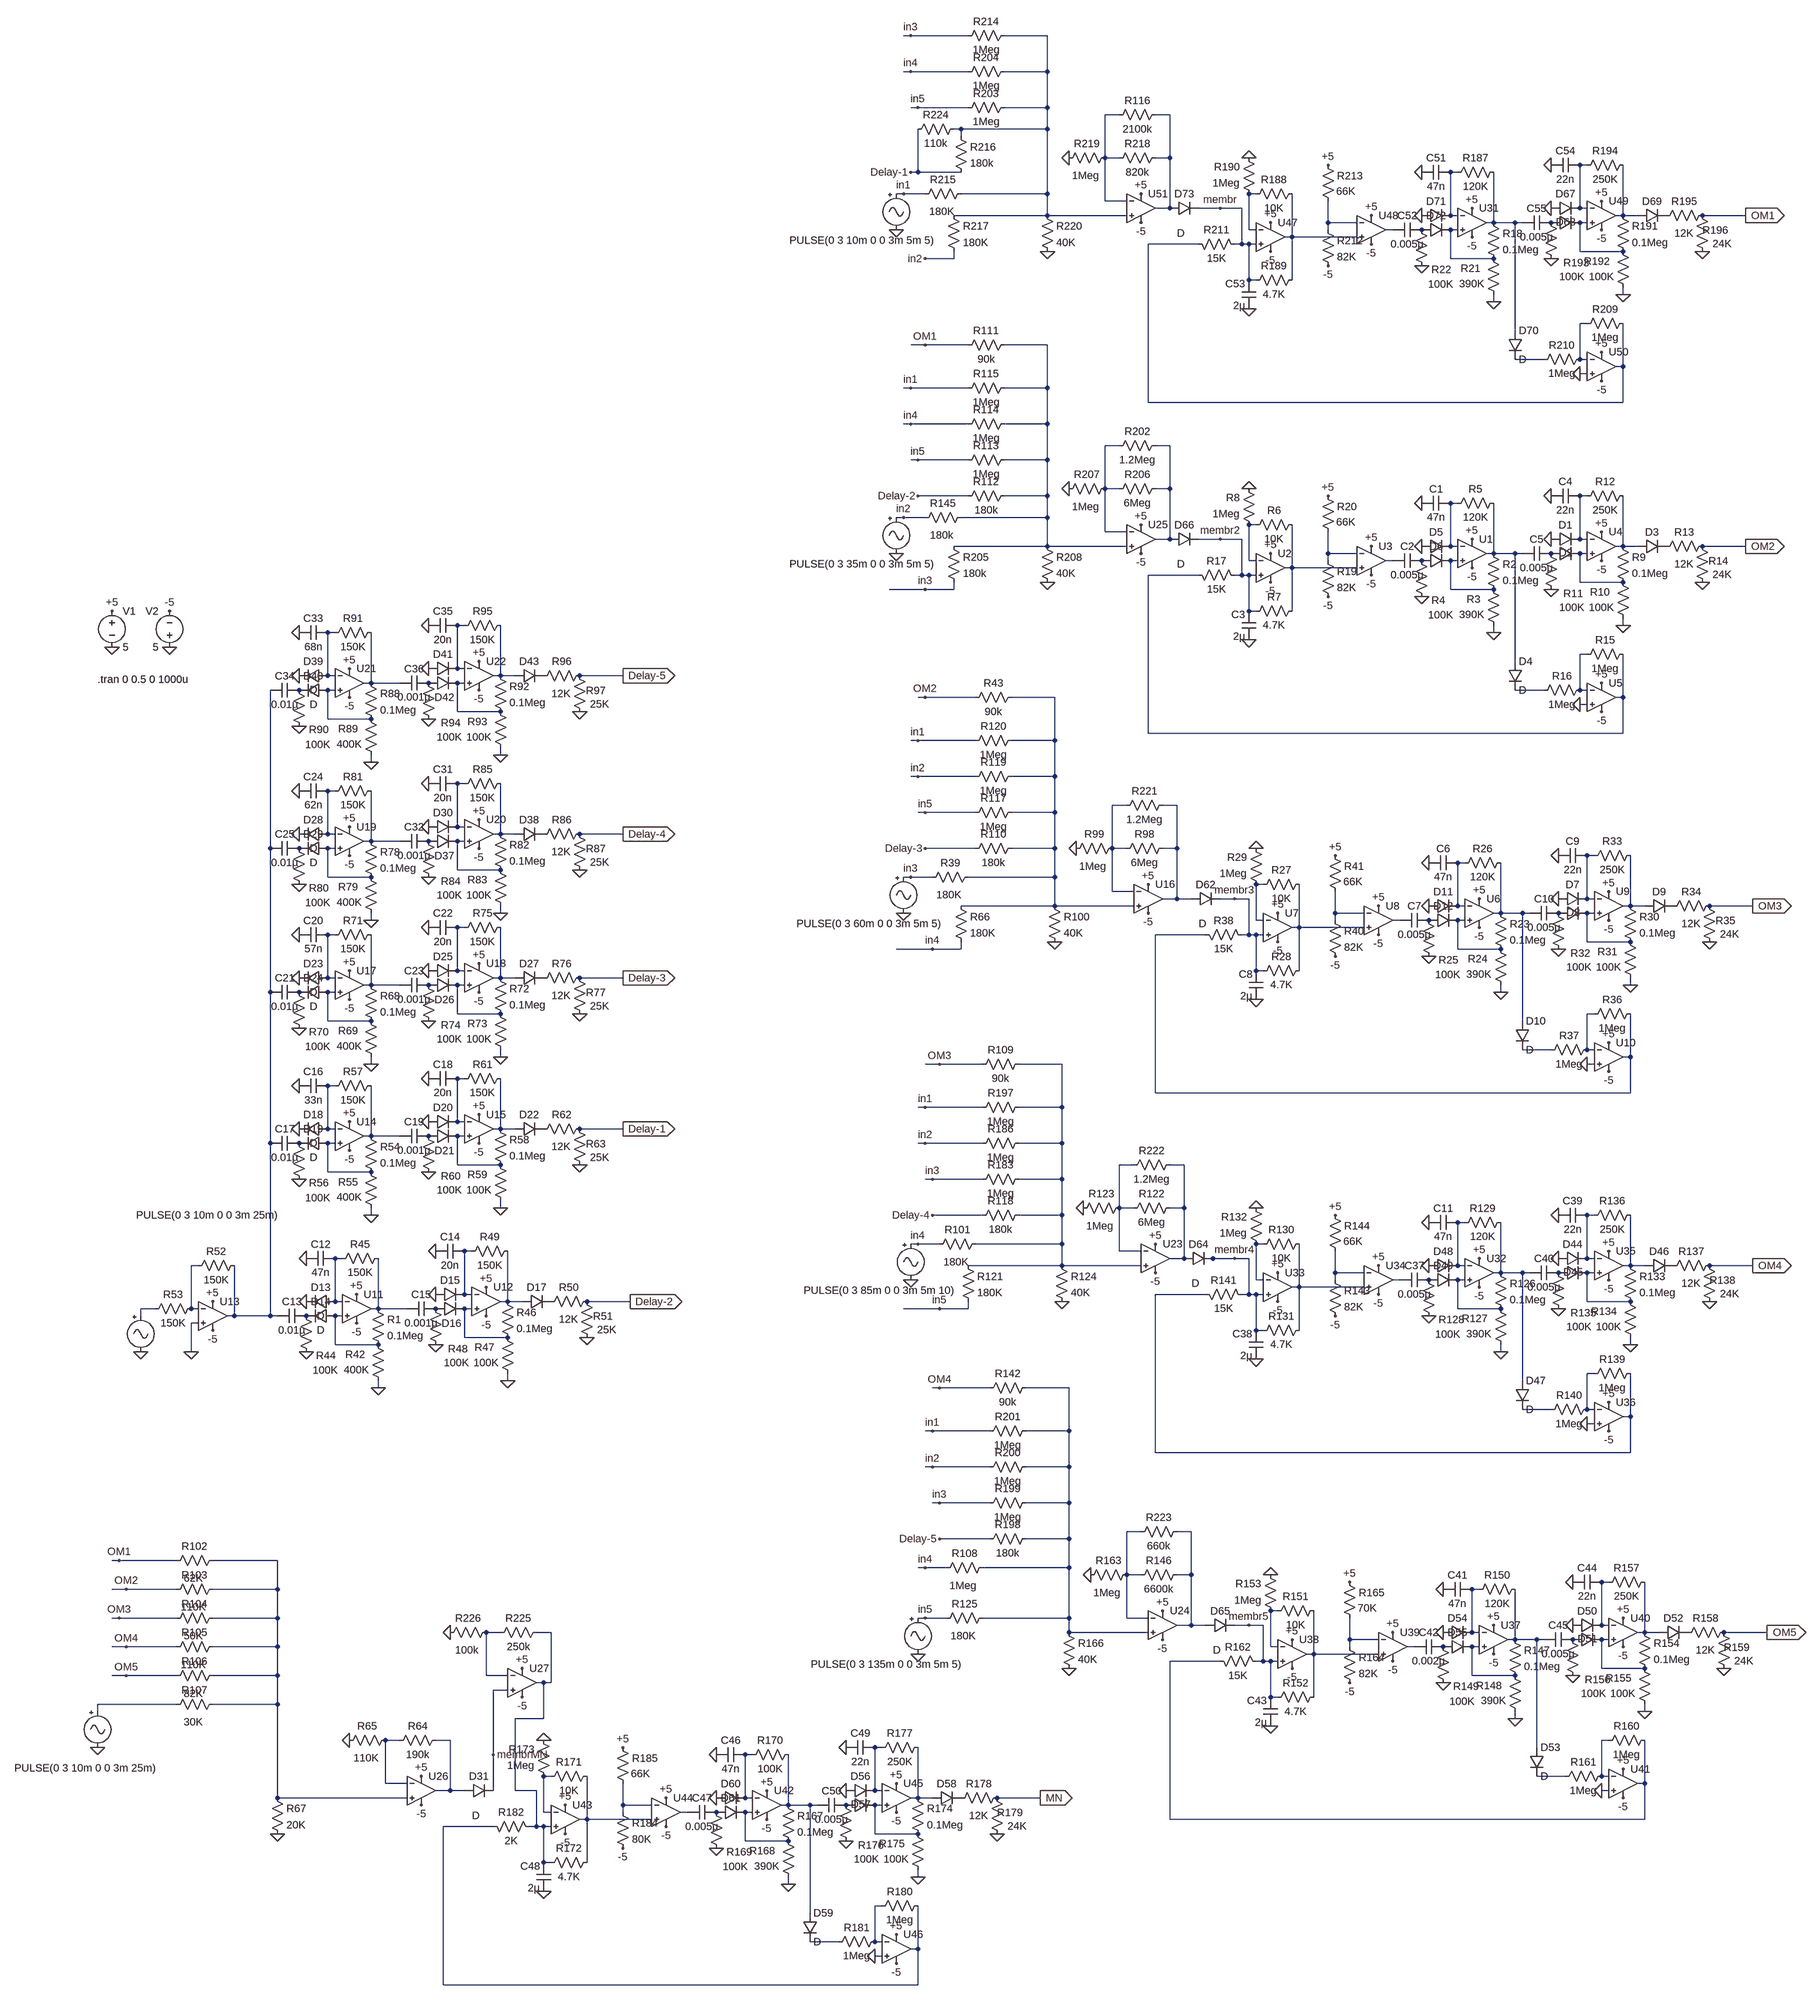
[diagram p0: schematic somaforprototype.asc]
* somaforprototype.asc
V1 +5 0 5
V2 0 -5 5
XU17 N065 N060 +5 -5 N063 level.2 Avol=1Meg GBW=10Meg Slew=10Meg ilimit=25m rail=0 Vos=0 phimargin=45 en=0 enk=0 in=0 ink=0 Rin=500Meg  ; pins IN+ IN- V+ V- OUT
D23 N060 0 D
D24 N065 P001 D
R68 N063 N065 0.1Meg
R69 0 N065 400K
R70 P001 0 100K
R71 N063 N060 150K
C20 N060 0 57n
C21 P001 N047 0.01µ
XU18 N064 N058 +5 -5 N062 level.2 Avol=1Meg GBW=10Meg Slew=10Meg ilimit=25m rail=0 Vos=0 phimargin=45 en=0 enk=0 in=0 ink=0 Rin=500Meg  ; pins IN+ IN- V+ V- OUT
D25 0 N058 D
D26 P002 N064 D
R72 N062 N064 0.1Meg
R73 0 N064 100K
R74 P002 0 100K
R75 N062 N058 150K
C22 N058 0 20n
C23 P002 N063 0.001µ
D27 N062 P003 D
R76 Delay-3 P003 12K
R77 0 Delay-3 25K
XU19 N048 N041 +5 -5 N045 level.2 Avol=1Meg GBW=10Meg Slew=10Meg ilimit=25m rail=0 Vos=0 phimargin=45 en=0 enk=0 in=0 ink=0 Rin=500Meg  ; pins IN+ IN- V+ V- OUT
D28 N041 0 D
D29 N048 P004 D
R78 N045 N048 0.1Meg
R79 0 N048 400K
R80 P004 0 100K
R81 N045 N041 150K
C24 N041 0 62n
C25 P004 N047 0.01µ
XU20 N046 N040 +5 -5 N044 level.2 Avol=1Meg GBW=10Meg Slew=10Meg ilimit=25m rail=0 Vos=0 phimargin=45 en=0 enk=0 in=0 ink=0 Rin=500Meg  ; pins IN+ IN- V+ V- OUT
D30 0 N040 D
D37 P005 N046 D
R82 N044 N046 0.1Meg
R83 0 N046 100K
R84 P005 0 100K
R85 N044 N040 150K
C31 N040 0 20n
C32 P005 N045 0.001µ
D38 N044 P006 D
R86 Delay-4 P006 12K
R87 0 Delay-4 25K
XU21 N037 N032 +5 -5 N035 level.2 Avol=1Meg GBW=10Meg Slew=10Meg ilimit=25m rail=0 Vos=0 phimargin=45 en=0 enk=0 in=0 ink=0 Rin=500Meg  ; pins IN+ IN- V+ V- OUT
D39 N032 0 D
D40 N037 P007 D
R88 N035 N037 0.1Meg
R89 0 N037 400K
R90 P007 0 100K
R91 N035 N032 150K
C33 N032 0 68n
C34 P007 N047 0.01µ
XU22 N036 N031 +5 -5 N034 level.2 Avol=1Meg GBW=10Meg Slew=10Meg ilimit=25m rail=0 Vos=0 phimargin=45 en=0 enk=0 in=0 ink=0 Rin=500Meg  ; pins IN+ IN- V+ V- OUT
D41 0 N031 D
D42 P008 N036 D
R92 N034 N036 0.1Meg
R93 0 N036 100K
R94 P008 0 100K
R95 N034 N031 150K
C35 N031 0 20n
C36 P008 N035 0.001µ
D43 N034 P009 D
R96 Delay-5 P009 12K
R97 0 Delay-5 25K
XU1 N028 N021 +5 -5 N025 level.2 Avol=1Meg GBW=10Meg Slew=10Meg ilimit=25m rail=0 Vos=0 phimargin=45 en=0 enk=0 in=0 ink=0 Rin=500Meg  ; pins IN+ IN- V+ V- OUT
R2 N025 N028 0.1Meg
R3 0 N028 390K
R4 P010 0 100K
R5 N025 N021 120K
C1 N021 0 47n
C2 P010 N027 0.005µ
XU2 membr2 N022 +5 -5 N029 level.2 Avol=1Meg GBW=10Meg Slew=10Meg ilimit=25m rail=0 Vos=0 phimargin=45 en=0 enk=0 in=0 ink=0 Rin=500Meg  ; pins IN+ IN- V+ V- OUT
C3 0 membr2 2µ
R6 N029 N022 10K
R7 N029 membr2 4.7K
R8 N022 0 1Meg
XU3 N029 N024 +5 -5 N027 level.2 Avol=1Meg GBW=10Meg Slew=10Meg ilimit=25m rail=0 Vos=0 phimargin=45 en=0 enk=0 in=0 ink=0 Rin=500Meg  ; pins IN+ IN- V+ V- OUT
XU4 N026 N020 +5 -5 N023 level.2 Avol=1Meg GBW=10Meg Slew=10Meg ilimit=25m rail=0 Vos=0 phimargin=45 en=0 enk=0 in=0 ink=0 Rin=500Meg  ; pins IN+ IN- V+ V- OUT
D1 0 N020 D
D2 P011 N026 D
R9 N023 N026 0.1Meg
R10 0 N026 100K
R11 P011 0 100K
R12 N023 N020 250K
C4 N020 0 22n
C5 P011 N025 0.005µ
D3 N023 P012 D
R13 OM2 P012 12K
R14 0 OM2 24K
XU5 0 N033 +5 -5 N030 level.2 Avol=1Meg GBW=10Meg Slew=10Meg ilimit=25m rail=0 Vos=0 phimargin=45 en=0 enk=0 in=0 ink=0 Rin=500Meg  ; pins IN+ IN- V+ V- OUT
R15 N030 N033 1Meg
R16 N038 N033 1Meg
D4 N025 N038 D
R17 N030 membr2 15K
R19 N024 -5 82K
R20 +5 N024 66K
D5 0 N021 D
D6 P010 N028 D
XU6 N057 N050 +5 -5 N054 level.2 Avol=1Meg GBW=10Meg Slew=10Meg ilimit=25m rail=0 Vos=0 phimargin=45 en=0 enk=0 in=0 ink=0 Rin=500Meg  ; pins IN+ IN- V+ V- OUT
R23 N054 N057 0.1Meg
R24 0 N057 390K
R25 P013 0 100K
R26 N054 N050 120K
C6 N050 0 47n
C7 P013 N056 0.005µ
XU7 membr3 N051 +5 -5 N059 level.2 Avol=1Meg GBW=10Meg Slew=10Meg ilimit=25m rail=0 Vos=0 phimargin=45 en=0 enk=0 in=0 ink=0 Rin=500Meg  ; pins IN+ IN- V+ V- OUT
C8 0 membr3 2µ
R27 N059 N051 10K
R28 N059 membr3 4.7K
R29 N051 0 1Meg
XU8 N059 N053 +5 -5 N056 level.2 Avol=1Meg GBW=10Meg Slew=10Meg ilimit=25m rail=0 Vos=0 phimargin=45 en=0 enk=0 in=0 ink=0 Rin=500Meg  ; pins IN+ IN- V+ V- OUT
XU9 N055 N049 +5 -5 N052 level.2 Avol=1Meg GBW=10Meg Slew=10Meg ilimit=25m rail=0 Vos=0 phimargin=45 en=0 enk=0 in=0 ink=0 Rin=500Meg  ; pins IN+ IN- V+ V- OUT
D7 0 N049 D
D8 P014 N055 D
R30 N052 N055 0.1Meg
R31 0 N055 100K
R32 P014 0 100K
R33 N052 N049 250K
C9 N049 0 22n
C10 P014 N054 0.005µ
D9 N052 P015 D
R34 OM3 P015 12K
R35 0 OM3 24K
XU10 0 N066 +5 -5 N061 level.2 Avol=1Meg GBW=10Meg Slew=10Meg ilimit=25m rail=0 Vos=0 phimargin=45 en=0 enk=0 in=0 ink=0 Rin=500Meg  ; pins IN+ IN- V+ V- OUT
R36 N061 N066 1Meg
R37 N067 N066 1Meg
D10 N054 N067 D
R38 N061 membr3 15K
R40 N053 -5 82K
R41 +5 N053 66K
D11 0 N050 D
D12 P013 N057 D
XU32 N088 N078 +5 -5 N085 level.2 Avol=1Meg GBW=10Meg Slew=10Meg ilimit=25m rail=0 Vos=0 phimargin=45 en=0 enk=0 in=0 ink=0 Rin=500Meg  ; pins IN+ IN- V+ V- OUT
R126 N085 N088 0.1Meg
R127 0 N088 390K
R128 P016 0 100K
R129 N085 N078 120K
C11 N078 0 47n
C37 P016 N087 0.005µ
XU33 membr4 N079 +5 -5 N089 level.2 Avol=1Meg GBW=10Meg Slew=10Meg ilimit=25m rail=0 Vos=0 phimargin=45 en=0 enk=0 in=0 ink=0 Rin=500Meg  ; pins IN+ IN- V+ V- OUT
C38 0 membr4 2µ
R130 N089 N079 10K
R131 N089 membr4 4.7K
R132 N079 0 1Meg
XU34 N089 N084 +5 -5 N087 level.2 Avol=1Meg GBW=10Meg Slew=10Meg ilimit=25m rail=0 Vos=0 phimargin=45 en=0 enk=0 in=0 ink=0 Rin=500Meg  ; pins IN+ IN- V+ V- OUT
XU35 N086 N077 +5 -5 N083 level.2 Avol=1Meg GBW=10Meg Slew=10Meg ilimit=25m rail=0 Vos=0 phimargin=45 en=0 enk=0 in=0 ink=0 Rin=500Meg  ; pins IN+ IN- V+ V- OUT
D44 0 N077 D
D45 P017 N086 D
R133 N083 N086 0.1Meg
R134 0 N086 100K
R135 P017 0 100K
R136 N083 N077 250K
C39 N077 0 22n
C40 P017 N085 0.005µ
D46 N083 P018 D
R137 OM4 P018 12K
R138 0 OM4 24K
XU36 0 N096 +5 -5 N090 level.2 Avol=1Meg GBW=10Meg Slew=10Meg ilimit=25m rail=0 Vos=0 phimargin=45 en=0 enk=0 in=0 ink=0 Rin=500Meg  ; pins IN+ IN- V+ V- OUT
R139 N090 N096 1Meg
R140 N098 N096 1Meg
D47 N085 N098 D
R141 N090 membr4 15K
R143 N084 -5 82K
R144 +5 N084 66K
D48 0 N078 D
D49 P016 N088 D
XU37 N112 N103 +5 -5 N109 level.2 Avol=1Meg GBW=10Meg Slew=10Meg ilimit=25m rail=0 Vos=0 phimargin=45 en=0 enk=0 in=0 ink=0 Rin=500Meg  ; pins IN+ IN- V+ V- OUT
R147 N109 N112 0.1Meg
R148 0 N112 390K
R149 P019 0 100K
R150 N109 N103 120K
C41 N103 0 47n
C42 P019 N111 0.002µ
XU38 membr5 N104 +5 -5 N113 level.2 Avol=1Meg GBW=10Meg Slew=10Meg ilimit=25m rail=0 Vos=0 phimargin=45 en=0 enk=0 in=0 ink=0 Rin=500Meg  ; pins IN+ IN- V+ V- OUT
C43 0 membr5 2µ
R151 N113 N104 10K
R152 N113 membr5 4.7K
R153 N104 0 1Meg
XU39 N113 N108 +5 -5 N111 level.2 Avol=1Meg GBW=10Meg Slew=10Meg ilimit=25m rail=0 Vos=0 phimargin=45 en=0 enk=0 in=0 ink=0 Rin=500Meg  ; pins IN+ IN- V+ V- OUT
XU40 N110 N102 +5 -5 N107 level.2 Avol=1Meg GBW=10Meg Slew=10Meg ilimit=25m rail=0 Vos=0 phimargin=45 en=0 enk=0 in=0 ink=0 Rin=500Meg  ; pins IN+ IN- V+ V- OUT
D50 0 N102 D
D51 P020 N110 D
R154 N107 N110 0.1Meg
R155 0 N110 100K
R156 P020 0 100K
R157 N107 N102 250K
C44 N102 0 22n
C45 P020 N109 0.005µ
D52 N107 P021 D
R158 OM5 P021 12K
R159 0 OM5 24K
XU41 0 N118 +5 -5 N114 level.2 Avol=1Meg GBW=10Meg Slew=10Meg ilimit=25m rail=0 Vos=0 phimargin=45 en=0 enk=0 in=0 ink=0 Rin=500Meg  ; pins IN+ IN- V+ V- OUT
R160 N114 N118 1Meg
R161 N122 N118 1Meg
D53 N109 N122 D
R162 N114 membr5 15K
R164 N108 -5 82K
R165 +5 N108 70K
D54 0 N103 D
D55 P019 N112 D
XU42 N128 N120 +5 -5 N125 level.2 Avol=1Meg GBW=10Meg Slew=10Meg ilimit=25m rail=0 Vos=0 phimargin=45 en=0 enk=0 in=0 ink=0 Rin=500Meg  ; pins IN+ IN- V+ V- OUT
R167 N125 N128 0.1Meg
R168 0 N128 390K
R169 P022 0 100K
R170 N125 N120 100K
C46 N120 0 47n
C47 P022 N127 0.005µ
XU43 N106 N121 +5 -5 N129 level.2 Avol=1Meg GBW=10Meg Slew=10Meg ilimit=25m rail=0 Vos=0 phimargin=45 en=0 enk=0 in=0 ink=0 Rin=500Meg  ; pins IN+ IN- V+ V- OUT
C48 0 N106 2µ
R171 N129 N121 10K
R172 N129 N106 4.7K
R173 N121 0 1Meg
XU44 N129 N124 +5 -5 N127 level.2 Avol=1Meg GBW=10Meg Slew=10Meg ilimit=25m rail=0 Vos=0 phimargin=45 en=0 enk=0 in=0 ink=0 Rin=500Meg  ; pins IN+ IN- V+ V- OUT
XU45 N126 N119 +5 -5 N123 level.2 Avol=1Meg GBW=10Meg Slew=10Meg ilimit=25m rail=0 Vos=0 phimargin=45 en=0 enk=0 in=0 ink=0 Rin=500Meg  ; pins IN+ IN- V+ V- OUT
D56 0 N119 D
D57 P023 N126 D
R174 N123 N126 0.1Meg
R175 0 N126 100K
R176 P023 0 100K
R177 N123 N119 250K
C49 N119 0 22n
C50 P023 N125 0.005µ
D58 N123 P024 D
R178 MN P024 12K
R179 0 MN 24K
XU46 0 N131 +5 -5 N130 level.2 Avol=1Meg GBW=10Meg Slew=10Meg ilimit=25m rail=0 Vos=0 phimargin=45 en=0 enk=0 in=0 ink=0 Rin=500Meg  ; pins IN+ IN- V+ V- OUT
R180 N130 N131 1Meg
R181 N132 N131 1Meg
D59 N125 N132 D
R182 N130 N106 2K
R184 N124 -5 80K
R185 +5 N124 66K
D60 0 N120 D
D61 P022 N128 D
R39 N039 in3 180K
V4 in3 0 PULSE(0 3 60m 0 0 3m 5m 5)
R66 N039 in4 180K
XU16 N039 N042 +5 -5 N043 level.2 Avol=1Meg GBW=10Meg Slew=10Meg ilimit=25m rail=0 Vos=0 phimargin=45 en=0 enk=0 in=0 ink=0 Rin=500Meg  ; pins IN+ IN- V+ V- OUT
R98 N043 N042 6Meg
R99 N042 0 1Meg
D62 N043 membr3 D
R100 N039 0 40K
R101 N068 in4 180K
V5 in4 0 PULSE(0 3 85m 0 0 3m 5m 10)
R121 N068 in5 180K
XU23 N068 N075 +5 -5 N076 level.2 Avol=1Meg GBW=10Meg Slew=10Meg ilimit=25m rail=0 Vos=0 phimargin=45 en=0 enk=0 in=0 ink=0 Rin=500Meg  ; pins IN+ IN- V+ V- OUT
R122 N076 N075 6Meg
R123 N075 0 1Meg
D64 N076 membr4 D
R124 N068 0 40K
R125 N097 in5 180K
V7 in5 0 PULSE(0 3 135m 0 0 3m 5m 5)
XU24 N097 N099 +5 -5 N100 level.2 Avol=1Meg GBW=10Meg Slew=10Meg ilimit=25m rail=0 Vos=0 phimargin=45 en=0 enk=0 in=0 ink=0 Rin=500Meg  ; pins IN+ IN- V+ V- OUT
R146 N100 N099 6600k
R163 N099 0 1Meg
D65 N100 membr5 D
R166 N097 0 40K
R145 N016 in2 180k
V10 in2 0 PULSE(0 3 35m 0 0 3m 5m 5)
R205 N016 in3 180k
XU25 N016 N018 +5 -5 N019 level.2 Avol=1Meg GBW=10Meg Slew=10Meg ilimit=25m rail=0 Vos=0 phimargin=45 en=0 enk=0 in=0 ink=0 Rin=500Meg  ; pins IN+ IN- V+ V- OUT
R206 N019 N018 6Meg
R207 N018 0 1Meg
D66 N019 membr2 D
R208 N016 0 40K
XU31 N012 N005 +5 -5 N009 level.2 Avol=1Meg GBW=10Meg Slew=10Meg ilimit=25m rail=0 Vos=0 phimargin=45 en=0 enk=0 in=0 ink=0 Rin=500Meg  ; pins IN+ IN- V+ V- OUT
R18 N009 N012 0.1Meg
R21 0 N012 390K
R22 P025 0 100K
R187 N009 N005 120K
C51 N005 0 47n
C52 P025 N011 0.005µ
XU47 membr N006 +5 -5 N013 level.2 Avol=1Meg GBW=10Meg Slew=10Meg ilimit=25m rail=0 Vos=0 phimargin=45 en=0 enk=0 in=0 ink=0 Rin=500Meg  ; pins IN+ IN- V+ V- OUT
C53 0 membr 2µ
R188 N013 N006 10K
R189 N013 membr 4.7K
R190 N006 0 1Meg
XU48 N013 N008 +5 -5 N011 level.2 Avol=1Meg GBW=10Meg Slew=10Meg ilimit=25m rail=0 Vos=0 phimargin=45 en=0 enk=0 in=0 ink=0 Rin=500Meg  ; pins IN+ IN- V+ V- OUT
XU49 N010 N004 +5 -5 N007 level.2 Avol=1Meg GBW=10Meg Slew=10Meg ilimit=25m rail=0 Vos=0 phimargin=45 en=0 enk=0 in=0 ink=0 Rin=500Meg  ; pins IN+ IN- V+ V- OUT
D67 0 N004 D
D68 P026 N010 D
R191 N007 N010 0.1Meg
R192 0 N010 100K
R193 P026 0 100K
R194 N007 N004 250K
C54 N004 0 22n
C55 P026 N009 0.005µ
D69 N007 P027 D
R195 OM1 P027 12K
R196 0 OM1 24K
XU50 0 N015 +5 -5 N014 level.2 Avol=1Meg GBW=10Meg Slew=10Meg ilimit=25m rail=0 Vos=0 phimargin=45 en=0 enk=0 in=0 ink=0 Rin=500Meg  ; pins IN+ IN- V+ V- OUT
R209 N014 N015 1Meg
R210 N017 N015 1Meg
D70 N009 N017 D
R211 N014 membr 15K
R212 N008 -5 82K
R213 +5 N008 66K
D71 0 N005 D
D72 P025 N012 D
R215 N001 in1 180K
R216 N001 Delay-1 180k
R217 N001 in2 180K
XU51 N001 N002 +5 -5 N003 level.2 Avol=1Meg GBW=10Meg Slew=10Meg ilimit=25m rail=0 Vos=0 phimargin=45 en=0 enk=0 in=0 ink=0 Rin=500Meg  ; pins IN+ IN- V+ V- OUT
R218 N003 N002 820k
R219 N002 0 1Meg
D73 N003 membr D
R220 N001 0 40K
V3 in1 0 PULSE(0 3 10m 0 0 3m 5m 5)
XU11 N095 N081 +5 -5 N093 level.2 Avol=1Meg GBW=10Meg Slew=10Meg ilimit=25m rail=0 Vos=0 phimargin=45 en=0 enk=0 in=0 ink=0 Rin=500Meg  ; pins IN+ IN- V+ V- OUT
D13 N081 0 D
D14 N095 P028 D
R1 N093 N095 0.1Meg
R42 0 N095 400K
R44 P028 0 100K
R45 N093 N081 150K
C12 N081 0 47n
C13 P028 N047 0.01µ
V11 N092 0 PULSE(0 3 10m 0 0 3m 25m)
XU12 N094 N080 +5 -5 N091 level.2 Avol=1Meg GBW=10Meg Slew=10Meg ilimit=25m rail=0 Vos=0 phimargin=45 en=0 enk=0 in=0 ink=0 Rin=500Meg  ; pins IN+ IN- V+ V- OUT
D15 0 N080 D
D16 P029 N094 D
R46 N091 N094 0.1Meg
R47 0 N094 100K
R48 P029 0 100K
R49 N091 N080 150K
C14 N080 0 20n
C15 P029 N093 0.001µ
D17 N091 P030 D
R50 Delay-2 P030 12K
R51 0 Delay-2 25K
XU13 0 N082 +5 -5 N047 level.2 Avol=1Meg GBW=10Meg Slew=10Meg ilimit=25m rail=0 Vos=0 phimargin=45 en=0 enk=0 in=0 ink=0 Rin=500Meg  ; pins IN+ IN- V+ V- OUT
R52 N047 N082 150K
R53 N082 N092 150K
XU14 N074 N070 +5 -5 N072 level.2 Avol=1Meg GBW=10Meg Slew=10Meg ilimit=25m rail=0 Vos=0 phimargin=45 en=0 enk=0 in=0 ink=0 Rin=500Meg  ; pins IN+ IN- V+ V- OUT
D18 N070 0 D
D19 N074 P031 D
R54 N072 N074 0.1Meg
R55 0 N074 400K
R56 P031 0 100K
R57 N072 N070 150K
C16 N070 0 33n
C17 P031 N047 0.01µ
XU15 N073 N069 +5 -5 N071 level.2 Avol=1Meg GBW=10Meg Slew=10Meg ilimit=25m rail=0 Vos=0 phimargin=45 en=0 enk=0 in=0 ink=0 Rin=500Meg  ; pins IN+ IN- V+ V- OUT
D20 0 N069 D
D21 P032 N073 D
R58 N071 N073 0.1Meg
R59 0 N073 100K
R60 P032 0 100K
R61 N071 N069 150K
C18 N069 0 20n
C19 P032 N072 0.001µ
D22 N071 P033 D
R62 Delay-1 P033 12K
R63 0 Delay-1 25K
XU26 N101 N116 +5 -5 N117 level.2 Avol=1Meg GBW=10Meg Slew=10Meg ilimit=25m rail=0 Vos=0 phimargin=45 en=0 enk=0 in=0 ink=0 Rin=500Meg  ; pins IN+ IN- V+ V- OUT
R64 N117 N116 190k
R65 N116 0 110K
D31 N117 membrMN D
R67 N101 0 20K
R102 N101 OM1 62K
R103 N101 OM2 110K
R104 N101 OM3 50K
R105 N101 OM4 110K
R106 N101 OM5 82K
R107 N101 N115 30K
V6 N115 0 PULSE(0 3 10m 0 0 3m 25m)
R111 N016 OM1 90k
R112 N016 Delay-2 180k
R113 N016 in5 1Meg
R114 N016 in4 1Meg
R115 N016 in1 1Meg
R43 N039 OM2 90k
R110 N039 Delay-3 180k
R117 N039 in5 1Meg
R119 N039 in2 1Meg
R120 N039 in1 1Meg
R109 N068 OM3 90k
R118 N068 Delay-4 180k
R183 N068 in3 1Meg
R186 N068 in2 1Meg
R197 N068 in1 1Meg
R108 N097 in4 1Meg
R142 N097 OM4 90k
R198 N097 Delay-5 180k
R199 N097 in3 1Meg
R200 N097 in2 1Meg
R201 N097 in1 1Meg
R203 N001 in5 1Meg
R204 N001 in4 1Meg
R214 N001 in3 1Meg
R116 N003 N002 2100k
R202 N019 N018 1.2Meg
R221 N043 N042 1.2Meg
R222 N076 N075 1.2Meg
R223 N100 N099 660k
R224 N001 Delay-1 110k
XU27 membrMN N105 +5 -5 N106 level.2 Avol=1Meg GBW=10Meg Slew=10Meg ilimit=25m rail=0 Vos=0 phimargin=45 en=0 enk=0 in=0 ink=0 Rin=500Meg  ; pins IN+ IN- V+ V- OUT
R225 N106 N105 250k
R226 N105 0 100k
.model D D
.lib standard.dio
.tran 0 0.5 0 1000u
.lib UniversalOpamps2.sub
.backanno
.end